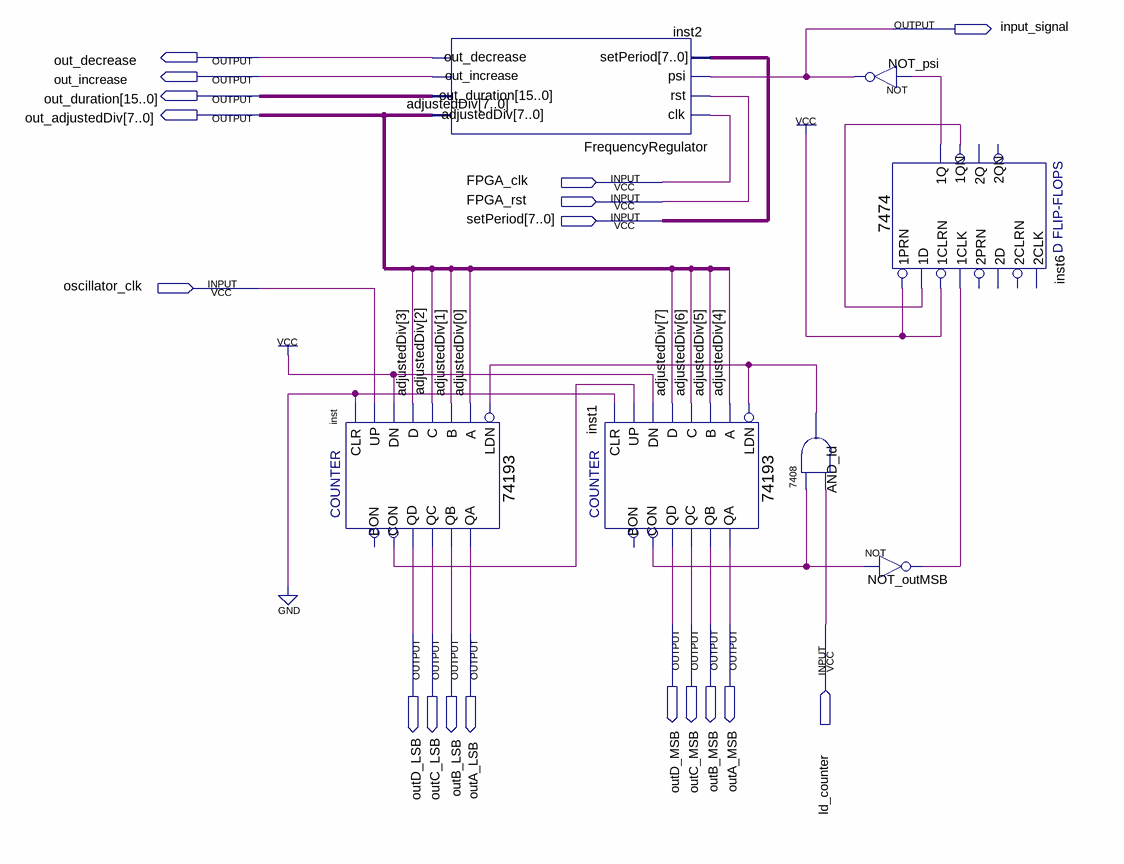
[diagram p0: schematic sheet]
// Quartus schematic Regulator.bdf as structural Verilog: 7 symbols, 18 pins
module Regulator (
  input  FPGA_clk,
  input  FPGA_rst,
  input  [7:0] setPeriod,
  input  oscillator_clk,
  input  ld_counter,
  output input_signal,
  output out_decrease,
  output out_increase,
  output [15:0] out_duration,
  output [7:0] out_adjustedDiv,
  output outD_MSB,
  output outC_MSB,
  output outB_MSB,
  output outA_MSB,
  output outD_LSB,
  output outC_LSB,
  output outB_LSB,
  output outA_LSB
);

  wire AND_ld_1, inst1_con, inst6_1q, inst6_1qn, inst_con, NOT_outMSB_out;

  \74193  inst (
    .D(out_adjustedDiv[3]), .C(out_adjustedDiv[2]), .B(out_adjustedDiv[1]), .A(out_adjustedDiv[0]),
    .CLR(1'b0), .UP(oscillator_clk), .DN(1'b1), .LDN(AND_ld_1), .QB(outB_LSB), .QA(outA_LSB), .CON(inst_con),
    .QD(outD_LSB), .QC(outC_LSB));  // open: BON
  FrequencyRegulator inst2 (
    .clk(FPGA_clk), .rst(FPGA_rst), .psi(input_signal), .setPeriod(setPeriod), .adjustedDiv(out_adjustedDiv),
    .out_duration(out_duration), .out_increase(out_increase), .out_decrease(out_decrease));
  \74193  inst1 (
    .D(out_adjustedDiv[7]), .C(out_adjustedDiv[6]), .B(out_adjustedDiv[5]), .A(out_adjustedDiv[4]),
    .CLR(1'b0), .UP(inst_con), .DN(1'b1), .LDN(AND_ld_1), .QB(outB_MSB), .QA(outA_MSB), .CON(inst1_con),
    .QD(outD_MSB), .QC(outC_MSB));  // open: BON
  \7408  AND_ld (.\3 (ld_counter), .\2 (inst1_con), .\1 (AND_ld_1));
  not NOT_psi (input_signal, inst6_1q);
  not NOT_outMSB (NOT_outMSB_out, inst1_con);
  \7474  inst6 (
    .\1CLK (NOT_outMSB_out), .\1D (inst6_1qn), .\1PRN (1'b1), .\1CLRN (1'b1), .\1QN (inst6_1qn),
    .\1Q (inst6_1q));  // open: 2D, 2PRN, 2CLK, 2CLRN, 2Q, 2QN

  // Other names for the same wires on the sheet: adjustedDiv[7:0] = out_adjustedDiv
endmodule
